# EAGLE design laserDriver (EAGLE 7.0.0)
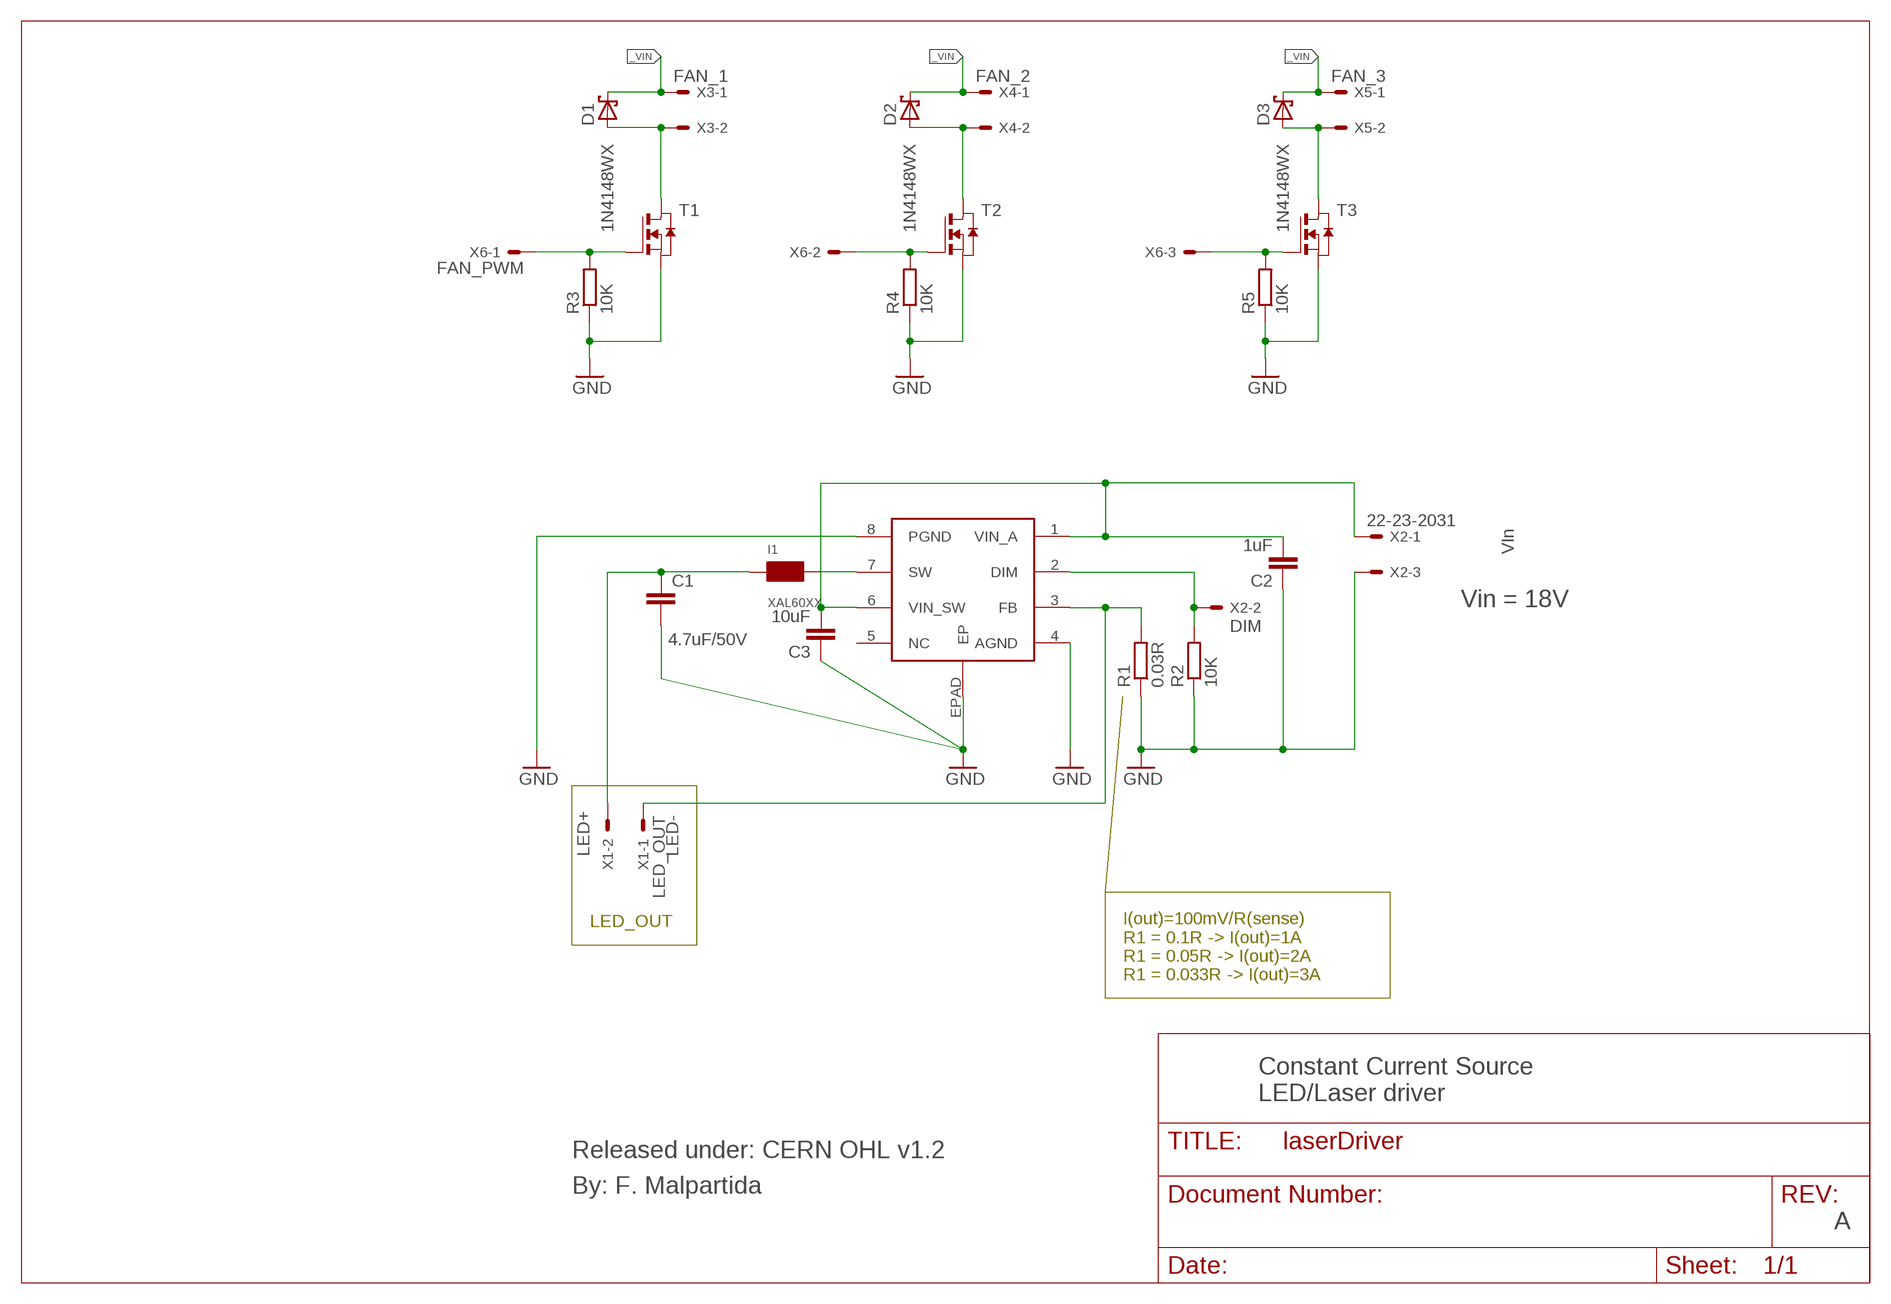
[diagram p0: schematic, sheet 1]

## Parts
C1  4.7uF/50V  C-EUC1206  [C1206]
C2  1uF  C-EUC1206  [C1206]
C3  10uF  C-EUC1206  [C1206]
D1  1N4148WX  BAT60J  [SOD323_ST]
D2  1N4148WX  BAT60J  [SOD323_ST]
D3  1N4148WX  BAT60J  [SOD323_ST]
I1  XAL60XX  [XAL60XX]
R1  0.03R  R-EU_R2512  [R2512]
R2  10K  R-EU_M0805  [M0805]
R3  10K  R-EU_M0805  [M0805]
R4  10K  R-EU_M0805  [M0805]
R5  10K  R-EU_M0805  [M0805]
T1  NMOSSOT23  [SOT-23]
T2  NMOSSOT23  [SOT-23]
T3  NMOSSOT23  [SOT-23]
U1  LED2001  [SO08_PWR]
X1  LED_OUT  22-23-2021  [22-23-2021]
X2  22-23-2031  [22-23-2031]
X3  FAN_1  22-23-2021  [22-23-2021]
X4  FAN_2  22-23-2021  [22-23-2021]
X5  FAN_3  22-23-2021  [22-23-2021]
X6  FAN_PWM  22-23-2031  [22-23-2031]

## Nets
_VIN: C2.2 C3.2 D1.C D2.C D3.C U1.1(VIN_A) U1.6(VIN_SW) X2.1 X3.1 X4.1 X5.1
_VOUT: C1.1 I1.P$1 X1.2
GND: C1.2 C2.1 C3.1 R1.1 R2.1 R3.1 R4.1 R5.1 T1.2(S) T2.2(S) T3.2(S) U1.4(AGND) U1.8(PGND) U1.EPAD(EP) X2.3
N$1: R1.2 U1.3(FB) X1.1
N$2: I1.P$2 U1.7(SW)
N$3: D1.A T1.1(D) X3.2
N$5: R2.2 U1.2(DIM) X2.2
N$7: D2.A T2.1(D) X4.2
N$8: D3.A T3.1(D) X5.2
N$10: R5.2 T3.3(G) X6.3
N$11: R4.2 T2.3(G) X6.2
N$12: R3.2 T1.3(G) X6.1
Unconnected: U1.5(NC)

## Notes on the sheet
- VIn
- Vin = 18V
- DIM
- LED+ | LED-
- LED_OUT
- I(out)=100mV/R(sense)
  R1 = 0.1R -> I(out)=1A
  R1 = 0.05R -> I(out)=2A
  R1 = 0.033R -> I(out)=3A
- Constant Current Source
  LED/Laser driver
- Released under: CERN OHL v1.2
- By: F. Malpartida
- A

## Library data of the parts
C1-C3 = rcl:C-EU: CAPACITOR, European symbol
D1-D3 = diode:BAT60J: Schottky barrier diode Source: www.st.com, BAT60J.pdf
I1 = fmc:XAL60XX
R1-R5 = rcl:R-EU_: RESISTOR, European symbol
T1-T3 = zetex:NMOSSOT23: MOS FET; OC_FARNELL: unknown; OC_NEWARK: unknown
U1 = fmc:LED2001
X1 X3-X5 = con-molex:22-23-2021: .100" (2.54mm) Center Header - 2 Pin; MF: MOLEX; MPN: 22-23-2021; OC_FARNELL: 1462926; OC_NEWARK: 25C3832
X2 X6 = con-molex:22-23-2031: .100" (2.54mm) Center Header - 3 Pin; MF: MOLEX; MPN: 22-23-2031; OC_FARNELL: 1462950; OC_NEWARK: 30C0862

## Board
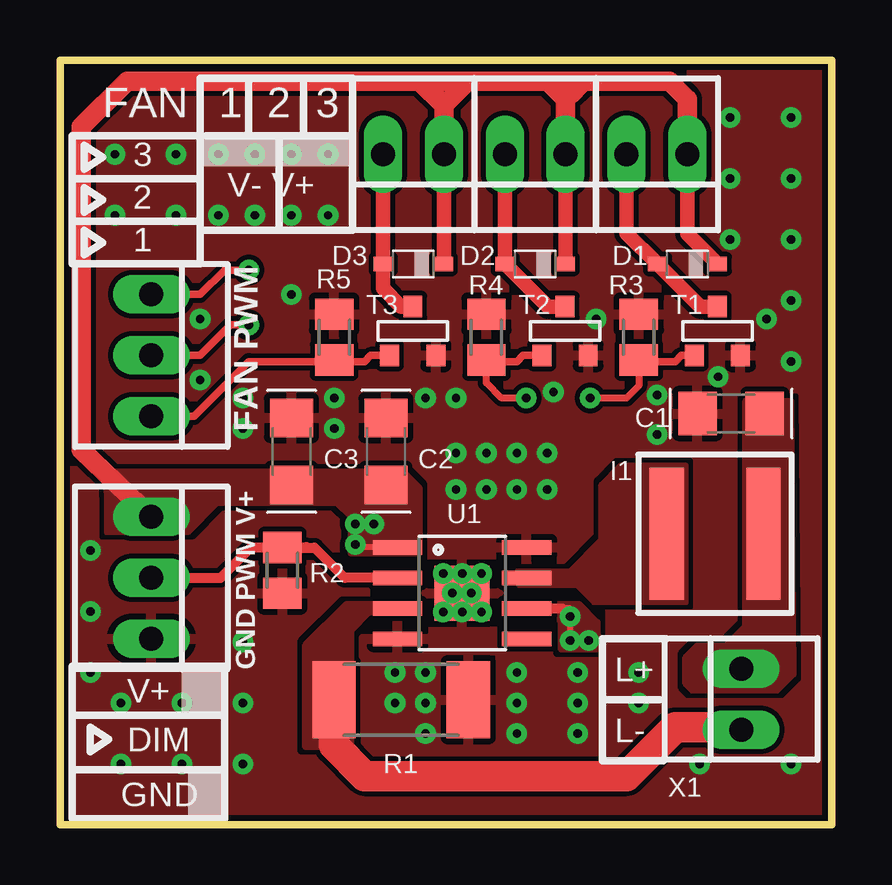
[diagram p1: board, top side]
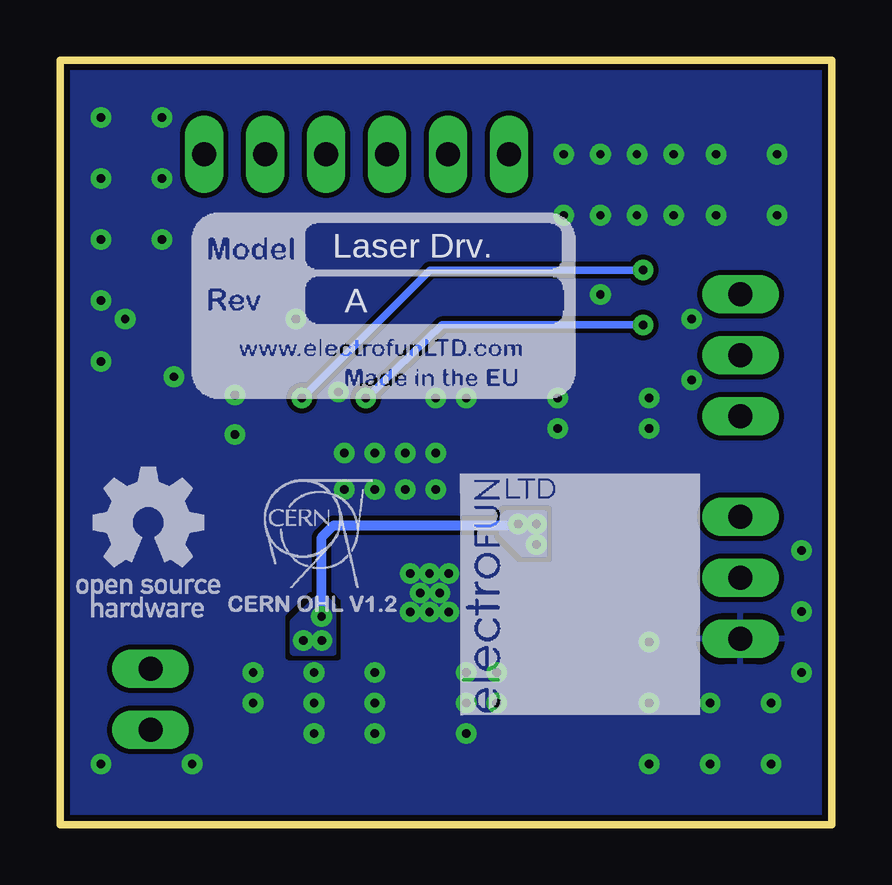
[diagram p2: board, bottom side, seen from below]

Size 32.18 x 31.87 mm. Coordinates in mm from the lower left corner, seen from the top.
Outline: 0,0 32.18,0 32.18,31.87 0,31.87 0,0
Copper layers (1*16): Top 0.035mm / dielectric 1.5mm / Bottom 0.035mm
Design rules "myDesignRules *": minimum track width 8mil, minimum drill 0.3mm, track to track 8mil, track to pad 8mil, pad to pad 8mil, via to via 8mil, smd to smd 8mil, copper to edge 10mil, drill to drill 8mil, minimum pad ring 12mil, minimum via ring 10mil, stop-mask expansion 4mil, vias tented up to drill 25mil, thermal gap 10mil

### Footprints (pad centres in the part's own frame; a part is rotated, then mirrored left to right if it is on the bottom)
C1206 = smd 1.6 x 1.8: 1 -1.4,0; 2 1.4,0
SOD323_ST = smd 0.8 x 0.6: A 1.25,0; C -1.25,0
XAL60XX = smd 1.43 x 5.5: P$1 -2.02,0; P$2 2.02,0
R2512 = smd 1.8 x 3.2: 1 -2.8,0; 2 2.8,0
M0805 = smd 1.3 x 1.6: 1 -0.95,0; 2 0.95,0
SOT-23 = smd 0.787 x 0.889: 1 0.025,-1.016; 2 -0.94,1.016; 3 0.991,1.016
SO08_PWR = smd 0.61 x 2.057: 1 -1.905,-2.692; 2 -0.635,-2.692; 3 0.635,-2.692; 4 1.905,-2.692; 5 1.905,2.692; 6 0.635,2.692; 7 -0.635,2.692; 8 -1.905,2.692 | smd 2.286 x 2.286: EPAD 0,0
22-23-2021 = drill 1 long: 1 -1.27,0; 2 1.27,0
22-23-2031 = drill 1 long: 1 -2.54,0; 2 0,0; 3 2.54,0

### Placement (x,y rotation side)
C1  27.98,17.13 180 top
C2  13.59,15.56 270 top
C3  9.65,15.56 270 top
D1  26.16,23.37 180 top
D2  19.81,23.37 180 top
D3  14.73,23.37 180 top
I1  27.3,12.13 180 top
R1  14.22,5.21 180 top
R2  9.27,10.6 90 top
R3  24.13,20.32 270 top
R4  17.78,20.32 270 top
R5  11.43,20.32 270 top
T1  27.43,20.57 180 top
T2  21.08,20.57 180 top
T3  14.73,20.57 180 top
U1  16.76,9.65 270 top
U$1  [OSHW]  31.5,8.64 0 bottom
U$2  [FMC_CERN_OHL]  25.15,8.89 0 bottom
U$3  [ELECTROFUN_10X10]  15.49,4.57 0 bottom
U$4  [BOARD_INFO_BMP_SMALL]  26.67,17.78 0 bottom
X1  28.4,5.24 90 top
X2  3.81,10.29 270 top
X3  24.89,27.94 180 top
X4  19.81,27.94 180 top
X5  14.73,27.94 180 top
X6  3.81,19.56 270 top

### Tracks (layer width: path | path; a pad name or v marks a point on that pad's centre or on a via)
_VIN  (via drill 0.35)
  Top 0.254: U1.1 12.57,11.56 v12.32,11.68 | v21.27,7.68 21.27,9.02 U1.6
  Top 0.305: X4.1 21.08,29.97 21.59,30.48 21.46,30.61 | 16,23.35 D3.C | 21.08,23.39 D2.C
  Top 0.406: U1.6 20.93,9.02 v21.27,8.67
  Top 0.61: 16,23.35 X5.1 | 21.08,23.39 X4.1 | X3.1 26.16,24.62 D1.C
  Top 0.813: X5.1 16,29.97 | 16,29.97 14.99,30.99 | 14.99,30.99 2.79,30.99 0.89,29.08 0.89,15.62 X2.1 | 21.84,30.99 25.4,30.99 26.16,30.23 X3.1 | 21.84,30.99 21.34,30.99 | 21.34,30.99 20.32,30.99 | 20.32,30.99 17.02,30.99 | 17.02,30.99 14.99,30.99 | X4.1 21.08,30.23 | 21.08,30.23 21.08,30.73 21.34,30.99 | 16,29.97 17.02,30.99 | 21.08,30.23 20.32,30.99 | 21.08,30.23 21.46,30.61 21.84,30.99
  Bottom 0.406: v21.27,8.67 21.27,11.97 20.77,12.47 13.15,12.47 v13.08,12.54
  other vias: 22.03,7.68 12.32,12.54
  pour Top (no thermals): 1.97,12.18 1.97,13.65 1.91,14.73 14.3,14.73 14.99,14.05 14.99,11.3 12.13,11.3 12.13,12.83 11.56,13.4 6.54,13.4 5.33,12.19
  pour Top: 18.8,9.21 21.65,9.21 22.42,8.45 22.42,7.3 20.89,7.3 20.89,8.45 20.51,8.83 18.8,8.83
  pour Bottom: 20.77,7.17 20.77,9.09 21.06,9.37 21.57,9.37 22.47,8.47 22.47,7.17
  pour Bottom: 11.97,12.97 13.57,12.97 13.77,12.77 13.77,12.17 12.87,11.27 11.97,11.27
_VOUT
  pour Top (no thermals): 28.57,17.67 30.47,17.67 30.57,6.27 29.88,5.58 26.37,5.58 26.07,5.88 26.07,6.98 26.57,7.48 27.77,7.48 28.57,8.28
GND  (via drill 0.35)
  other vias: 15.97,10.47 16.77,10.47 17.57,10.47 17.57,8.87 16.77,8.87 15.97,8.87 16.35,9.66 17.15,9.66 2.54,5.08 5.08,5.08 7.62,5.08 2.54,2.54 5.08,2.54 7.62,2.54 13.97,6.35 15.24,6.35 13.97,5.08 15.24,5.08 15.24,3.81 19.05,6.35 19.05,5.08 19.05,3.81 21.59,6.35 21.59,5.08 21.59,3.81 24.13,6.35 24.13,5.08 24.89,16.26 24.89,17.91 16.51,13.97 26.67,2.54 30.48,2.54 17.78,13.97 19.05,13.97 20.32,13.97 20.32,15.49 19.05,15.49 17.78,15.49 16.51,15.49 16.51,17.78 11.43,17.78 11.43,16.51 7.62,17.78 7.62,16.51 7.62,7.62 1.27,11.43 1.27,8.89 15.24,17.78 22.35,21.08 9.65,22.1 5.84,21.08 5.84,18.54 29.46,21.08 27.43,18.67 20.57,18.03 6.6,25.4 8.13,25.4 9.65,25.4 11.18,25.4 11.18,27.94 9.65,27.94 8.13,27.94 6.6,27.94 4.83,27.94 4.83,25.4 2.29,25.4 2.29,27.94 27.94,24.38 30.48,24.38 30.48,26.92 27.94,26.92 27.94,29.46 30.48,29.46 30.48,21.84 30.48,19.3 1.27,6.35
  pour Top (rank 5): 0.25,31.5 32,31.5 32,0.25 0.25,0.25
  pour Bottom (rank 5): 0.25,31.75 32,31.75 32,0.25 0.25,0.25
N$1
  Top 1.27: R1.2 11.42,3.31 12.7,2.03 23.62,2.03 25.65,4.06 28.31,4.06 X1.1
  pour Top (no thermals): 14.8,8.83 12.89,8.83 12.13,8.06 12.13,3.24 10.22,3.24 10.22,7.49 11.94,9.21 14.8,9.21
N$2
  pour Top (no thermals): 19.07,10.57 21.27,10.57 22.57,11.87 22.57,14.17 23.37,14.97 26.07,14.97 26.07,9.27 22.27,9.27 21.57,9.97 19.17,9.97 19.07,10.07
N$3
  Top 0.61: X3.2 23.62,24.66 D1.A 26.69,21.59 T1.1
N$5
  Top 0.406: U1.2 11.87,10.29 10.61,11.55 R2.2 10.27,11.57 7.97,11.57 6.69,10.29 X2.2
N$7
  Top 0.61: X4.2 18.56,27.92 D2.A 20.34,21.59 T2.1
N$8
  Top 0.61: X5.2 13.46,23.39 D3.A 13.46,23.35 13.46,22.35 14.22,21.59 T3.1
N$10
  Top 0.305: X6.3 5.59,17.02 7.87,19.3 11.36,19.3 R5.2 11.5,19.3 12.7,19.3 12.95,19.56 T3.3
N$11  (via drill 0.35)
  Top 0.3: v19.43,17.78 18.41,17.78 17.78,18.41 R4.2
  Top 0.305: T2.3 19.3,19.56 19.05,19.3 17.85,19.3 R4.2 | v7.87,20.83 7.11,20.83 5.84,19.56 X6.2
  Bottom 0.305: v7.87,20.83 16.26,20.83 v19.43,17.78
N$12  (via drill 0.35)
  Top 0.3: R3.2 24.13,18.29 23.62,17.78 v22.1,17.78
  Top 0.305: T1.3 25.91,19.56 25.65,19.3 24.2,19.3 R3.2 | v7.87,23.11 6.86,23.11 5.84,22.1 X6.1
  Bottom 0.305: v7.87,23.11 16.76,23.11 v22.1,17.78

### Text on the board
tPlace: FAN | 1 | 2 | 3 | 3 | 2 | V- V+ | 1 | FAN PWM | GND PWM V+ | L+ | V+ | DIM | L- | GND
bPlace: Laser Drv. | A